# Altium schematic sheet UV16 PDU.SchDoc: Power Distribution Unit
size Letter; Date: 2015-11-11; Revision: A; ProjectTitle: UV16 PDU
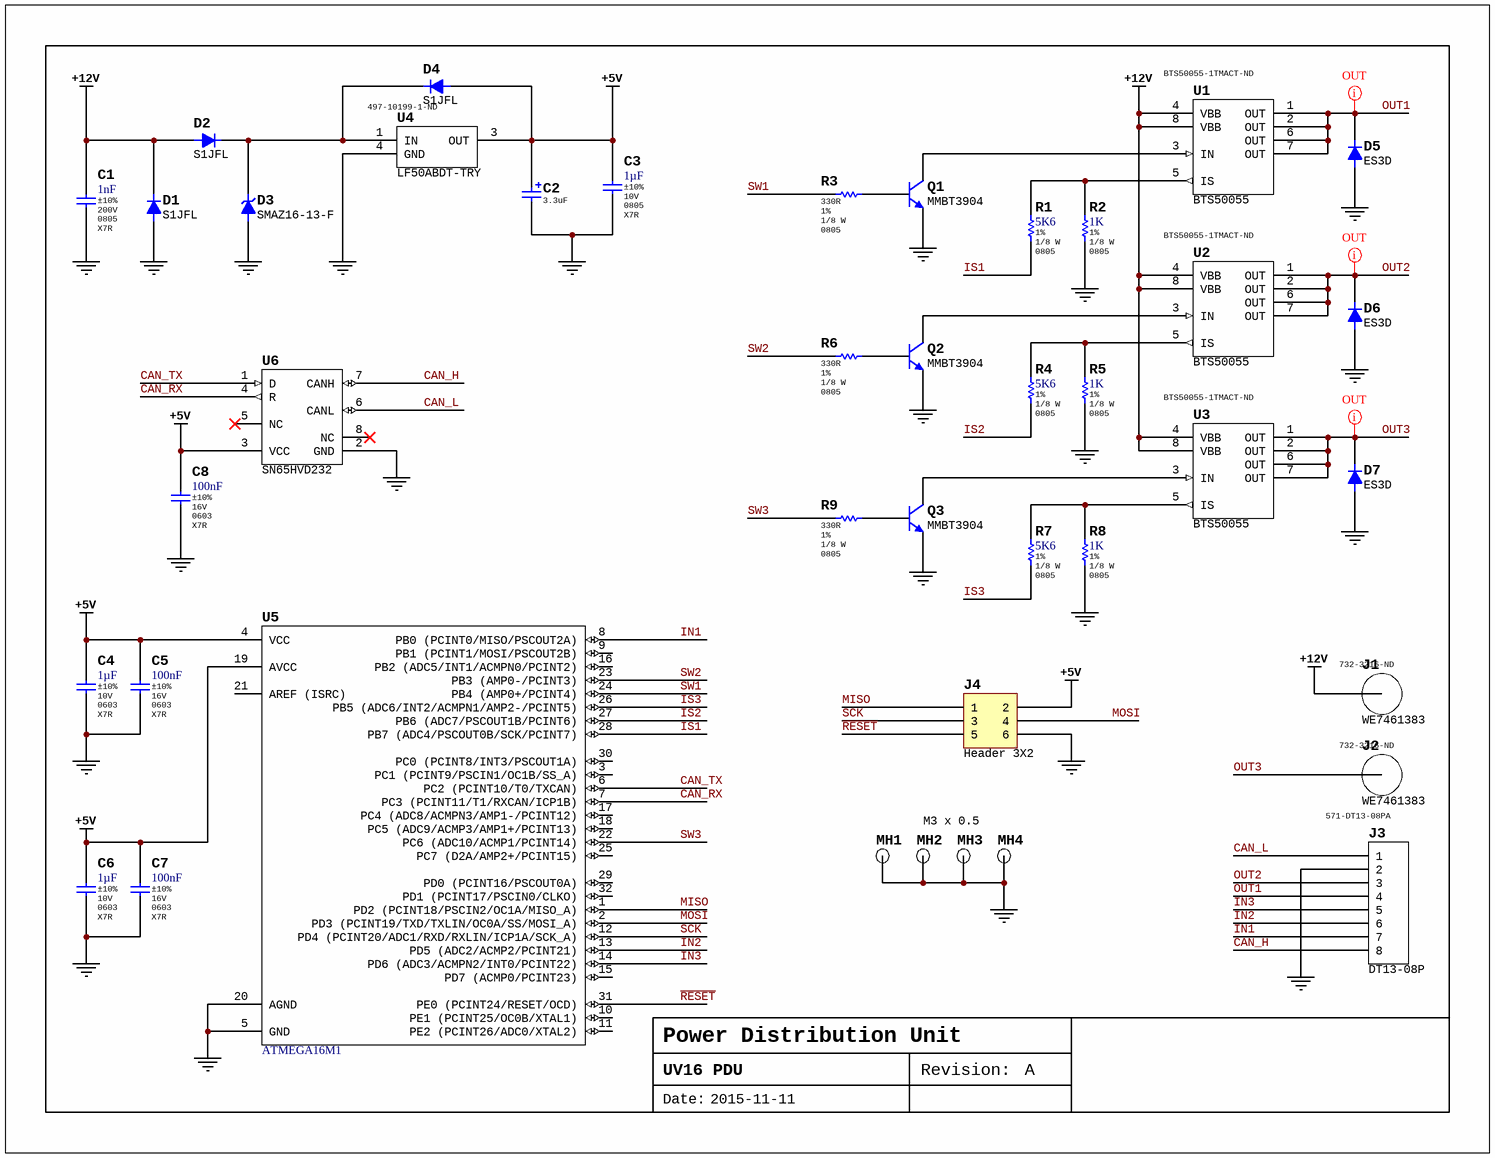
[diagram p0: UV16 PDU.SchDoc]

## Parts
C1  1nF  Tolerance: ±10%  Voltage: 200V  Package: 0805  Temperature Coefficient: X7R  [CAP-0805-M]
C2  value 3.3uF  [CAPMP6032X21M]  (hidden comment: TPSC335K035R0700)
C3  1µF  Tolerance: ±10%  Voltage: 10V  Package: 0805  Temperature Coefficient: X7R  [CAP-0805-M]
C4  1µF  Tolerance: ±10%  Voltage: 10V  Package: 0603  Temperature Coefficient: X7R  [CAP-0603-M]
C5  100nF  Tolerance: ±10%  Voltage: 16V  Package: 0603  Temperature Coefficient: X7R  [CAP-0603-M]
C6  1µF  Tolerance: ±10%  Voltage: 10V  Package: 0603  Temperature Coefficient: X7R  [CAP-0603-M]
C7  100nF  Tolerance: ±10%  Voltage: 16V  Package: 0603  Temperature Coefficient: X7R  [CAP-0603-M]
C8  100nF  Tolerance: ±10%  Voltage: 16V  Package: 0603  Temperature Coefficient: X7R  [CAP-0603-M]
D1  S1JFL  [DIOM3617X11M]
D2  S1JFL  [DIOM3617X11M]
D3  SMAZ16-13-F  [DIOM4326X23M]
D4  S1JFL  [DIOM3617X11M]
D5  ES3D  [DIOM6959X26M]
D6  ES3D  [DIOM6959X26M]
D7  ES3D  [DIOM6959X26M]
J1  WE7461383  Supplier Part Number 1: 732-3216-ND  [WE7461383]
J2  WE7461383  Supplier Part Number 1: 732-3216-ND  [WE7461383]
J3  DT13-08P  Supplier Part Number 1: 571-DT13-08PA  [DT13-08P]
J4  Header 3X2  [HDR2X3]
MH1  M3 x 0.5  [MH-M3-0.5]
MH2  M3 x 0.5  [MH-M3-0.5]  (value not drawn)
MH3  M3 x 0.5  [MH-M3-0.5]  (value not drawn)
MH4  M3 x 0.5  [MH-M3-0.5]  (value not drawn)
Q1  MMBT3904  [SOT23-3]
Q2  MMBT3904  [SOT23-3]
Q3  MMBT3904  [SOT23-3]
R1  5K6  Tolerance: 1%  Power: 1/8 W  Package: 0805  [RES-0805-M]
R2  1K  Tolerance: 1%  Power: 1/8 W  Package: 0805  [RES-0805-M]
R3  Tolerance: 1%  Power: 1/8 W  Package: 0805  [RES-0805-M]  (hidden comment: 330R)
R4  5K6  Tolerance: 1%  Power: 1/8 W  Package: 0805  [RES-0805-M]
R5  1K  Tolerance: 1%  Power: 1/8 W  Package: 0805  [RES-0805-M]
R6  Tolerance: 1%  Power: 1/8 W  Package: 0805  [RES-0805-M]  (hidden comment: 330R)
R7  5K6  Tolerance: 1%  Power: 1/8 W  Package: 0805  [RES-0805-M]
R8  1K  Tolerance: 1%  Power: 1/8 W  Package: 0805  [RES-0805-M]
R9  Tolerance: 1%  Power: 1/8 W  Package: 0805  [RES-0805-M]  (hidden comment: 330R)
U1  BTS50055  Supplier Part Number 1: BTS50055-1TMACT-ND  [P/PG-TO220-7-4]
U2  BTS50055  Supplier Part Number 1: BTS50055-1TMACT-ND  [P/PG-TO220-7-4]
U3  BTS50055  Supplier Part Number 1: BTS50055-1TMACT-ND  [P/PG-TO220-7-4]
U4  LF50ABDT-TRY  Supplier Part Number 1: 497-10199-1-ND  [TO-252-3]
U5  ATMEGA16M1  [32-TQFP-7x7-0.8]
U6  SN65HVD232  [8-SOIC]

## Nets
+5V: C2.1 C3.2 C4.2 C5.2 C6.1 C7.1 C8.1 D4.2(A) J4.2 U4.3(OUT) U5.4(VCC) U5.19(AVCC) U6.3(VCC)
+12V: C1.2 D1.1(K) D2.2(A) J1.0 U1.4(VBB) U1.8(VBB) U2.4(VBB) U2.8(VBB) U3.4(VBB) U3.8(VBB)
GND: C1.1 C2.2 C3.1 C4.1 C5.1 C6.2 C7.2 C8.2 D1.2(A) D3.2(A) D5.2(A) D6.2(A) D7.2(A) J3.2 J4.6 MH1.0 MH2.0 MH3.0 MH4.0 Q1.2(E) Q2.2(E) Q3.2(E) R2.2 R5.2 R8.2 U4.4(GND) U5.5(GND) U5.20(AGND) U6.2(GND)
CAN_H: J3.8 U6.7(CANH)
CAN_L: J3.1 U6.6(CANL)
CAN_RX: U5.7(PC3_(PCINT11/T1/RXCAN/ICP1B)) U6.4(R)
CAN_TX: U5.6(PC2_(PCINT10/T0/TXCAN)) U6.1(D)
IN1: J3.7 U5.8(PB0_(PCINT0/MISO/PSCOUT2A))
IN2: J3.6 U5.13(PD5_(ADC2/ACMP2/PCINT21))
IN3: J3.5 U5.14(PD6_(ADC3/ACMPN2/INT0/PCINT22))
IS1: R1.1 U5.28(PB7_(ADC4/PSCOUT0B/SCK/PCINT7))
IS2: R4.1 U5.27(PB6_(ADC7/PSCOUT1B/PCINT6))
IS3: R7.1 U5.26(PB5_(ADC6/INT2/ACMPN1/AMP2-/PCINT5))
MISO: J4.1 U5.1(PD2_(PCINT18/PSCIN2/OC1A/MISO_A))
MOSI: J4.4 U5.2(PD3_(PCINT19/TXD/TXLIN/OC0A/SS/MOSI_A))
OUT1: D5.1(K) J3.4 U1.1(OUT) U1.2(OUT) U1.6(OUT) U1.7(OUT)
OUT2: D6.1(K) J3.3 U2.1(OUT) U2.2(OUT) U2.6(OUT) U2.7(OUT)
OUT3: D7.1(K) J2.0 U3.1(OUT) U3.2(OUT) U3.6(OUT) U3.7(OUT)
~{RESET}: J4.5 U5.31(PE0_(PCINT24/RESET/OCD))
SCK: J4.3 U5.12(PD4_(PCINT20/ADC1/RXD/RXLIN/ICP1A/SCK_A))
SW1: R3.1 U5.24(PB4_(AMP0+/PCINT4))
SW2: R6.1 U5.23(PB3_(AMP0-/PCINT3))
SW3: R9.1 U5.22(PC6_(ADC10/ACMP1/PCINT14))
NetD2_1: D2.1(K) D3.1(K) D4.1(K) U4.1(IN)
NetQ1_1: Q1.1(B) R3.2
NetQ1_3: Q1.3(C) U1.3(IN)
NetQ2_1: Q2.1(B) R6.2
NetQ2_3: Q2.3(C) U2.3(IN)
NetQ3_1: Q3.1(B) R9.2
NetQ3_3: Q3.3(C) U3.3(IN)
NetR1_2: R1.2 R2.1 U1.5(IS)
NetR4_2: R4.2 R5.1 U2.5(IS)
NetR7_2: R7.2 R8.1 U3.5(IS)

Not connected (* = marked no-connect by the designer): U5 3(PC1_(PCINT9/PSCIN1/OC1B/SS_A)) 9(PB1_(PCINT1/MOSI/PSCOUT2B)) 10(PE1_(PCINT25/OC0B/XTAL1)) 11(PE2_(PCINT26/ADC0/XTAL2)) 15(PD7_(ACMP0/PCINT23)) 16(PB2_(ADC5/INT1/ACMPN0/PCINT2)) 17(PC4_(ADC8/ACMPN3/AMP1-/PCINT12)) 18(PC5_(ADC9/ACMP3/AMP1+/PCINT13)) 21(AREF_(ISRC)) 25(PC7_(D2A/AMP2+/PCINT15)) 29(PD0_(PCINT16/PSCOUT0A)) 30(PC0_(PCINT8/INT3/PSCOUT1A)) 32(PD1_(PCINT17/PSCIN0/CLKO)); U6 5(NC)* 8(NC)*

## Layout directives
net class OUT: OUT1, OUT2, OUT3

## Notes on the sheet
- Date:
- Revision:

## Library data of the parts
C1 = CC0805KRX7RABB102: Manufacturer: Yageo; Manufacturer Series: CC; Part Number: CC0805KRX7RABB102; Component Type: Standard; Value: 1nF; Temperature Range: -55°C ~ 125°C; Supplier 1: Digi-Key; Supplier Part Number 1: 311-1469-1-ND
C3 = CC0805KKX7R6BB105: Manufacturer: Yageo; Manufacturer Series: CC; Part Number: CC0805KKX7R6BB105; Component Type: Standard; Value: 1µF; Temperature Range: -55°C ~ 125°C; Supplier 1: Digi-Key; Supplier Part Number 1: 311-1458-1-ND
C4 C6 = CC0603KRX7R6BB105: Manufacturer: Yageo; Manufacturer Series: CC; Part Number: CC0603KRX7R6BB105; Component Type: Standard; Value: 1µF; Temperature Range: -55°C ~ 125°C; Supplier 1: Digi-Key; Supplier Part Number 1: 311-1796-1-ND
C5 C7 C8 = CC0603KPX7R7BB104: Manufacturer: Yageo; Manufacturer Series: CC; Part Number: CC0603KPX7R7BB104; Component Type: Standard; Value: 100nF; Temperature Range: -55°C ~ 125°C; Supplier 1: Digi-Key; Supplier Part Number 1: 311-1335-1-ND
J3 = DT13-08P: DT Series 8-Pin Right Angle PCB Mount Receptacle; Supplier 1: Mouser
J4 = Header 3X2: Header, 3-Pin, Dual row; LatestRevisionDate: 17-Jul-2002; LatestRevisionNote: Re-released for DXP Platform.; Publisher: Altium Limited
MH1-MH4 = MH-M3-0.5
R1 R4 R7 = RC0805FR-075K6L: Manufacturer: Yageo; Manufacturer Series: RC; Temperature Coefficient: ±100ppm/°C; Part Number: RC0805FR-075K6L; Value: 5K6; Component Type: Standard; Temperature Range: -55°C ~ 155°C; Supplier 1: Digi-Key; Supplier Part Number 1: 311-5.60KCRCT-ND
R2 R5 R8 = RC0805FR-071KL: Manufacturer: Yageo; Manufacturer Series: RC; Temperature Coefficient: ±100ppm/°C; Part Number: RC0805FR-071KL; Value: 1K; Component Type: Standard; Temperature Range: -55°C ~ 155°C; Supplier 1: Digi-Key; Supplier Part Number 1: 311-1.00KCRCT-ND
R3 R6 R9 = RC0805FR-07330RL: Manufacturer: Yageo; Manufacturer Series: RC; Temperature Coefficient: ±100ppm/°C; Part Number: RC0805FR-07330RL; Value: 330R; Component Type: Standard; Temperature Range: -55°C ~ 155°C; Supplier 1: Digi-Key; Supplier Part Number 1: 311-330CRCT-ND
U5 = ATMEGA16M1-15AZ: Supplier 1: Digi-Key; Supplier 2: Mouser; Supplier Part Number 1: ATMEGA16M1-15AZCT-ND; Supplier Part Number 2: 556-ATMEGA16M1-15AZ
U6 = SN65HVD232: CAN transceiver; Supplier 1: Digi-Key; Supplier Part Number 1: 296-26344-1-ND
C2 = TPSC335K035R0700: Supplier 1: Digi-Key; Supplier Part Number 1: 478-1769-1-ND
D1 D2 D4 = S1JFL: Supplier 1: Digi-Key; Supplier Part Number 1: ES1JFLCT-ND
D3 = SMAZ16-13-F: Supplier 1: Digi-Key; Supplier Part Number 1: SMAZ16-FDICT-ND
D5-D7 = ES3D: Supplier 1: Mouser; Supplier Part Number 1: 512-ES3D
J1 J2 = WE7461383: Supplier 1: Digi-Key
Q1-Q3 = MMBT3904: Supplier 1: Digi-Key; Supplier Part Number 1: MMBT3904LT1GOSCT-ND
U1-U3 = BTS50055: Supplier 1: Digi-Key
U4 = LF50ABDT-TRY: Supplier 1: Digi-Key